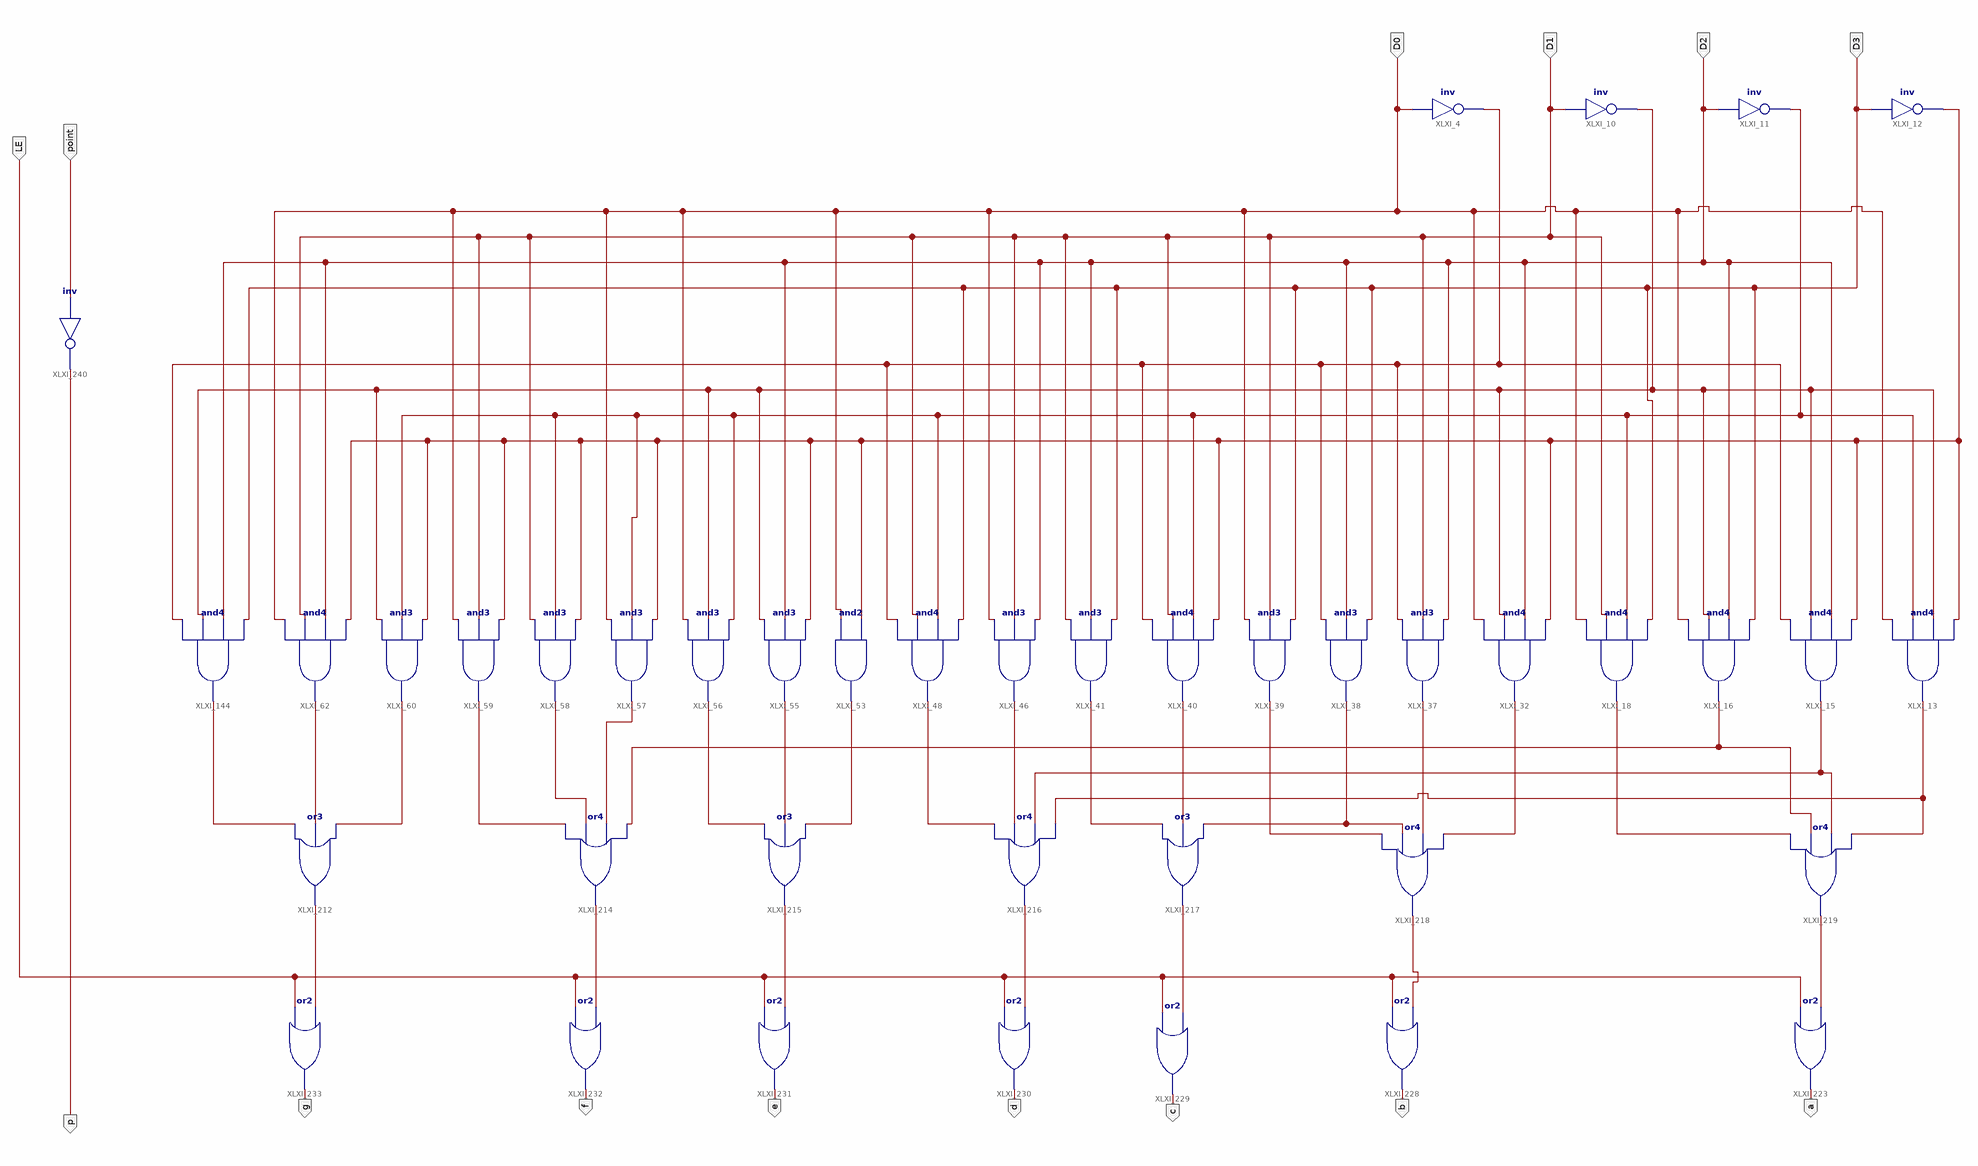
[diagram p0: schematic sheet 1]
// Xilinx ISE schematic MC14495_SCH.sch (kintex7) as structural Verilog: 40 symbols, 14 ports
module MC14495_SCH (
  input  D1,
  input  D2,
  input  D0,
  input  D3,
  input  LE,
  input  point,
  output p,
  output a,
  output b,
  output c,
  output d,
  output e,
  output f,
  output g
);

  wire XLXN_9, XLXN_15, XLXN_314, XLXN_391, XLXN_392, XLXN_393, XLXN_394, XLXN_395, XLXN_398, XLXN_399,
       XLXN_400, XLXN_401, XLXN_402, XLXN_403, XLXN_406, XLXN_407, XLXN_408, XLXN_414, XLXN_419, XLXN_420,
       XLXN_421, XLXN_423, XLXN_424, XLXN_425, XLXN_430, XLXN_439, XLXN_441, XLXN_442, XLXN_443, XLXN_444,
       XLXN_445, XLXN_499;

  not XLXI_4 (XLXN_9, D0);
  not XLXI_10 (XLXN_314, D1);
  not XLXI_11 (XLXN_499, D2);
  not XLXI_12 (XLXN_15, D3);
  and XLXI_144 (XLXN_392, XLXN_9, XLXN_314, D2, D3);
  and XLXI_62 (XLXN_391, D0, D1, D2, XLXN_15);
  and XLXI_60 (XLXN_393, XLXN_314, XLXN_499, XLXN_15);
  and XLXI_59 (XLXN_394, D0, D1, XLXN_15);
  and XLXI_58 (XLXN_395, D1, XLXN_499, XLXN_15);
  and XLXI_57 (XLXN_403, D0, XLXN_499, XLXN_15);
  and XLXI_56 (XLXN_398, D0, XLXN_314, XLXN_499);
  and XLXI_55 (XLXN_399, XLXN_314, D2, XLXN_15);
  and XLXI_53 (XLXN_400, D0, XLXN_15);
  and XLXI_48 (XLXN_401, XLXN_9, D1, XLXN_499, D3);
  and XLXI_46 (XLXN_402, D0, D1, D2);
  and XLXI_41 (XLXN_408, D1, D2, D3);
  and XLXI_40 (XLXN_407, XLXN_9, D1, XLXN_499, XLXN_15);
  and XLXI_39 (XLXN_419, D0, D1, D3);
  and XLXI_38 (XLXN_420, XLXN_9, D2, D3);
  and XLXI_37 (XLXN_414, XLXN_9, D1, D2);
  and XLXI_32 (XLXN_421, D0, XLXN_314, D2, XLXN_15);
  and XLXI_18 (XLXN_425, D0, D1, XLXN_499, D3);
  and XLXI_16 (XLXN_424, D0, XLXN_314, D2, D3);
  and XLXI_15 (XLXN_423, XLXN_9, XLXN_314, D2, XLXN_15);
  and XLXI_13 (XLXN_406, D0, XLXN_499, XLXN_314, XLXN_15);
  or XLXI_212 (XLXN_445, XLXN_392, XLXN_391, XLXN_393);
  or XLXI_214 (XLXN_444, XLXN_394, XLXN_395, XLXN_403, XLXN_424);
  or XLXI_215 (XLXN_443, XLXN_398, XLXN_399, XLXN_400);
  or XLXI_216 (XLXN_442, XLXN_401, XLXN_402, XLXN_423, XLXN_406);
  or XLXI_217 (XLXN_441, XLXN_408, XLXN_407, XLXN_420);
  or XLXI_218 (XLXN_439, XLXN_419, XLXN_420, XLXN_414, XLXN_421);
  or XLXI_219 (XLXN_430, XLXN_425, XLXN_424, XLXN_423, XLXN_406);
  or XLXI_223 (a, LE, XLXN_430);
  or XLXI_228 (b, LE, XLXN_439);
  or XLXI_229 (c, LE, XLXN_441);
  or XLXI_230 (d, LE, XLXN_442);
  or XLXI_231 (e, LE, XLXN_443);
  or XLXI_232 (f, LE, XLXN_444);
  or XLXI_233 (g, LE, XLXN_445);
  not XLXI_240 (p, point);
endmodule
